# EAGLE design pihat2 (EAGLE 9.6.2)
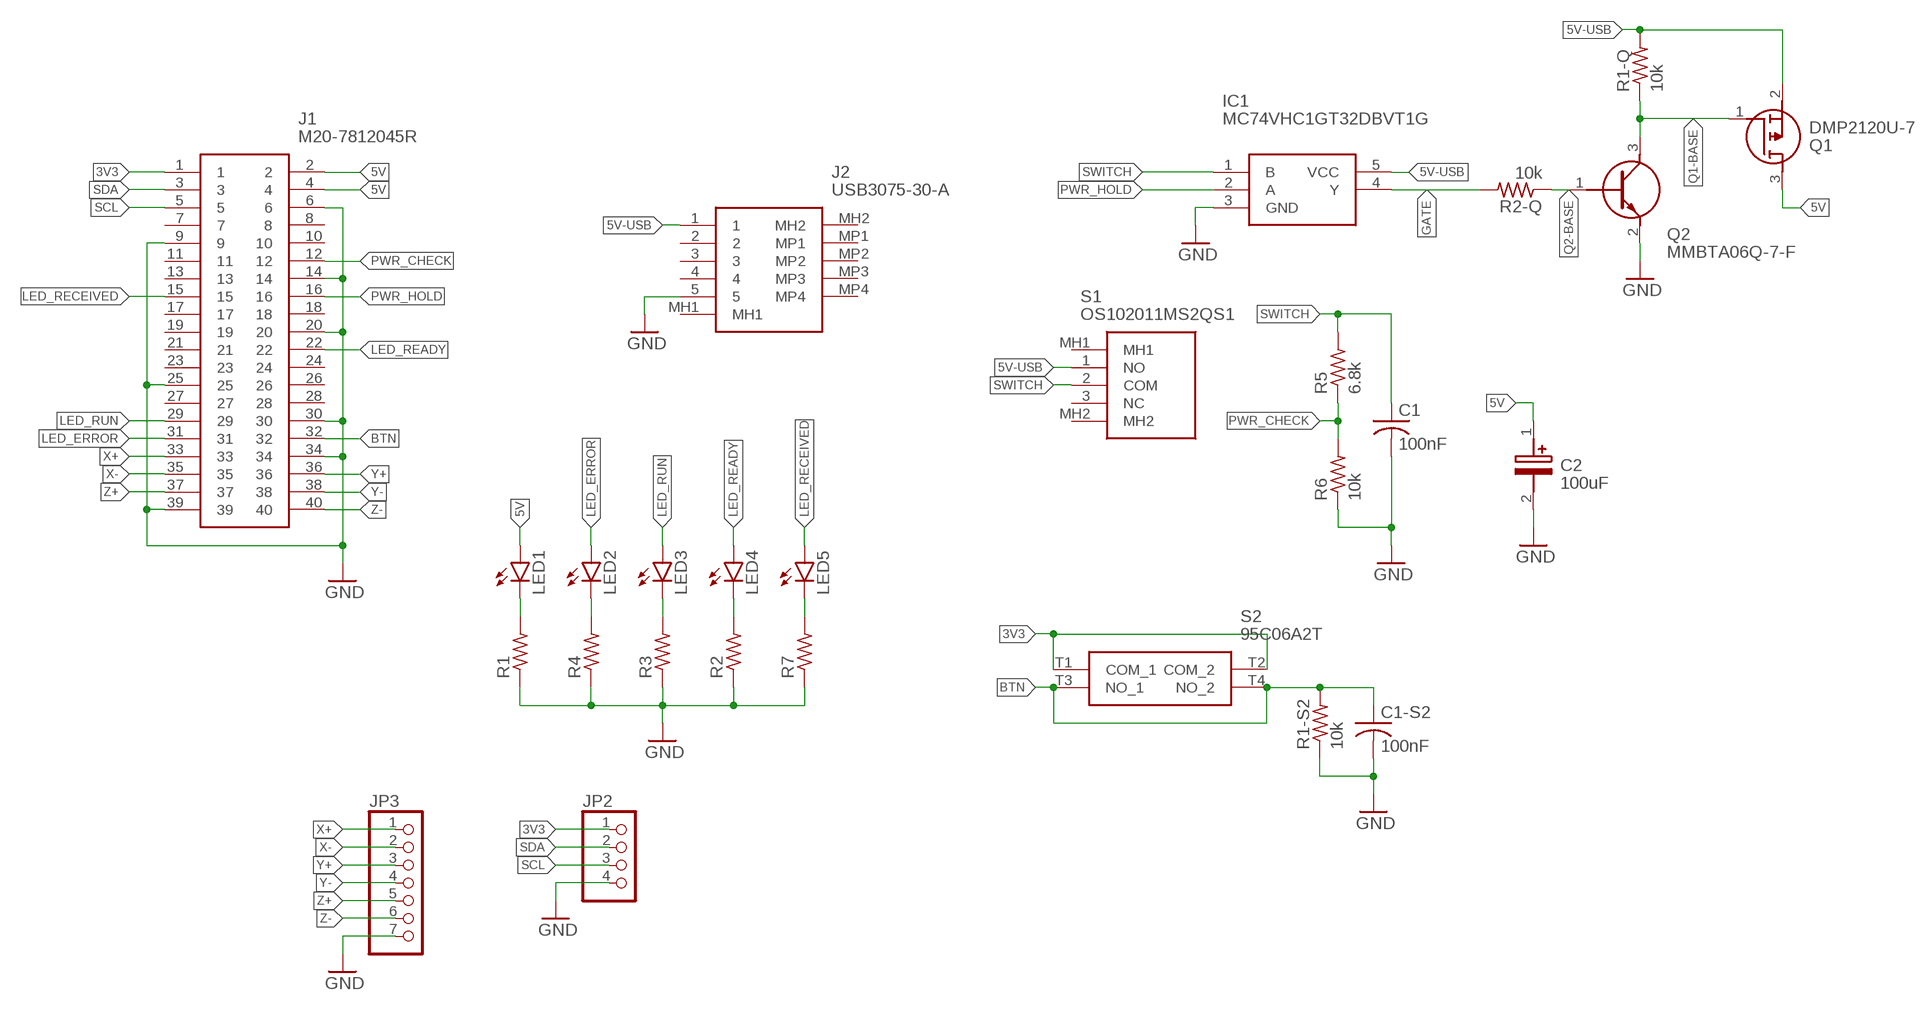
[diagram p0: schematic, sheet 1]

## Parts
C1  100nF  C-USC0805  [C0805]
C1-S2  100nF  C-USC0805  [C0805]
C2  100uF  10ML100MEFC6.3X5  [CAPPRD250W45D630H500]
IC1  MC74VHC1GT32DBVT1G  [MC74VHC1GT32DBVT1G]
J1  M20-7812045R  [M207812045R]
J2  USB3075-30-A  [USB307530A]
JP2  PINHD-1X4  [1X04]
JP3  PINHD-1X7  [1X07]
LED1  LED5MM  [LED5MM]
LED2  LED5MM  [LED5MM]
LED3  LED5MM  [LED5MM]
LED4  LED5MM  [LED5MM]
LED5  LED5MM  [LED5MM]
Q1  DMP2120U-7  [SOT96P240X110-3N]
Q2  MMBTA06Q-7-F  [SOT95P240X120-3N]
R1  R-US_R0805  [R0805]
R1-Q  10k  R-US_R0805  [R0805]
R1-S2  10k  R-US_R0805  [R0805]
R2  R-US_R0805  [R0805]
R2-Q  10k  R-US_R0805  [R0805]
R3  R-US_R0805  [R0805]
R4  R-US_R0805  [R0805]
R5  6.8k  R-US_R0805  [R0805]
R6  10k  R-US_R0805  [R0805]
R7  R-US_R0805  [R0805]
S1  OS102011MS2QS1  [OS102011MS2QS1]
S2  95C06A2T  [95C06A2T]

## Nets
3V3: J1.1 JP2.1 S2.T1(COM_1) S2.T2(COM_2)
5V: C2.1(+) J1.2 J1.4 LED1.A Q1.3(D)
5V-USB: IC1.5(VCC) J2.1 Q1.2(S) R1-Q.2 S1.1(NO)
BTN: C1-S2.1 J1.32 R1-S2.2 S2.T3(NO_1) S2.T4(NO_2)
GATE: IC1.4(Y) R2-Q.2
GND: C1-S2.2 C1.2 C2.2(-) IC1.3(GND) J1.6 J1.9 J1.14 J1.20 J1.25 J1.30 J1.34 J1.39 J2.5 JP2.4 JP3.7 Q2.2(E) R1-S2.1 R1.1 R2.1 R3.1 R4.1 R6.1 R7.1
LED_ERROR: J1.31 LED2.A
LED_READY: J1.22 LED4.A
LED_RECEIVED: J1.15 LED5.A
LED_RUN: J1.29 LED3.A
N$1: LED1.K(C) R1.2
N$2: LED2.K(C) R4.2
N$3: LED3.K(C) R3.2
N$4: LED4.K(C) R2.2
N$11: LED5.K(C) R7.2
PWR_CHECK: J1.12 R5.1 R6.2
PWR_HOLD: IC1.2(A) J1.16
Q1-BASE: Q1.1(G) Q2.3(C) R1-Q.1
Q2-BASE: Q2.1(B) R2-Q.1
SCL: J1.5 JP2.3
SDA: J1.3 JP2.2
SWITCH: C1.1 IC1.1(B) R5.2 S1.2(COM)
X+: J1.33 JP3.1
X-: J1.35 JP3.2
Y+: J1.36 JP3.3
Y-: J1.38 JP3.4
Z+: J1.37 JP3.5
Z-: J1.40 JP3.6
Unconnected: J1.7 J1.8 J1.10 J1.11 J1.13 J1.17 J1.18 J1.19 J1.21 J1.23 J1.24 J1.26 J1.27 J1.28 J2.2 J2.3 J2.4 J2.MH1 J2.MH2 J2.MP1 J2.MP2 J2.MP3 J2.MP4 S1.3(NC) S1.MH1 S1.MH2

## Library data of the parts
C1 C1-S2 = rcl:C-US: CAPACITOR, American symbol; SPICEPREFIX: C
C2 = SamacSys_Parts:10ML100MEFC6.3X5: Rubycon 100uF 10 V dc Aluminium Electrolytic Capacitor, ML Series 3000h 6.3 Dia. x 5mm Source: Datasheet <http://www.rubycon.co.jp/en/catalog/e_pdfs/aluminum/e_ml.pdf>; DESCRIPTION: Rubycon 100uF 10 V dc Aluminium Electrolytic Capacitor, ML Series 3000h 6.3 Dia. x 5mm; HEIGHT: 5mm; MANUFACTURER_NAME: Rubycon; MANUFACTURER_PART_NUMBER: 10ML100MEFC6.3X5; MOUSER_PART_NUMBER: 232-10ML100MEFC6.3X5; MOUSER_PRICE-STOCK: https://www.mouser.co.uk/ProductDetail/Rubycon/10ML100MEFC63X5?qs=T3oQrply3y%2Ft1pH0%2F%252B5skA%3D%3D
IC1 = SamacSys_Parts:MC74VHC1GT32DBVT1G: Logic Gates Single 2-Input OR Gate TTL Level Source: Datasheet <https://www.onsemi.com/pub/Collateral/MC74VHC1G32-D.PDF>; DESCRIPTION: Logic Gates Single 2-Input OR Gate TTL Level; HEIGHT: 1.1mm; MANUFACTURER_NAME: ON Semiconductor; MANUFACTURER_PART_NUMBER: MC74VHC1GT32DBVT1G; MOUSER_PART_NUMBER: 863-MC74VHC1GT32DBVG; MOUSER_PRICE-STOCK: https://www.mouser.co.uk/ProductDetail/onsemi/MC74VHC1GT32DBVT1G?qs=vLWxofP3U2z75t%252B%2F4%252B1fSQ%3D%3D
J1 = SamacSys_Parts:M20-7812045R: 2.54mm (0.1") Pitch DIL SMT Dual Entry Socket Assembly, with locating pegs, selective gold + tin, 20+20 contacts, with pick & place cap (Tape & Reel packing) Source: Datasheet <https://cdn.harwin.com/pdfs/M20-781.pdf>; DESCRIPTION: 2.54mm (0.1") Pitch DIL SMT Dual Entry Socket Assembly, with locating pegs, selective gold + tin, 20+20 contacts, with pick & place cap (Tape & Reel packing); HEIGHT: 4mm; MANUFACTURER_NAME: Harwin; MANUFACTURER_PART_NUMBER: M20-7812045R; MOUSER_PART_NUMBER: 855-M20-7812045R; MOUSER_PRICE-STOCK: https://www.mouser.co.uk/ProductDetail/Harwin/M20-7812045R?qs=k41KVqW3ymrSUFsY4Ced7g%3D%3D
J2 = SamacSys_Parts:USB3075-30-A: GCT (GLOBAL CONNECTOR TECHNOLOGY) - USB3075-30-A - USB Connector, Micro USB Type B, USB 2.0, Receptacle, 5 Ways, Surface Mount, Right Angle Source: Datasheet <https://componentsearchengine.com/Datasheets/2/USB3075-30-A.pdf>; DESCRIPTION: GCT (GLOBAL CONNECTOR TECHNOLOGY) - USB3075-30-A - USB Connector, Micro USB Type B, USB 2.0, Receptacle, 5 Ways, Surface Mount, Right Angle; HEIGHT: 2.7mm; MANUFACTURER_NAME: GCT (GLOBAL CONNECTOR TECHNOLOGY); MANUFACTURER_PART_NUMBER: USB3075-30-A; MOUSER_PART_NUMBER: 640-USB3075-30-A; MOUSER_PRICE-STOCK: https://www.mouser.co.uk/ProductDetail/GCT/USB3075-30-A?qs=KUoIvG%2F9IlbGMJplbp1ybA%3D%3D
JP2 = pinhead:PINHD-1X4: PIN HEADER
JP3 = pinhead:PINHD-1X7: PIN HEADER
LED1-LED5 = led:LED: LED OSRAM: - CHIPLED LG R971, LG N971, LY N971, LG Q971, LY Q971, LO R971, LY R971 LH N974, LH R974 LS Q976, LO Q976, LY Q976 LO Q996 - Hyper CHIPLED LW Q18S LB Q993, LB Q99A, LB R99A - SideLED LS A670, LO A670, LY A670, LG A670, LP A670 LB A673, LV A673, LT A673, LW A673 LH A674 LY A675 LS A676, LA A676, LO A676, LY A676, LW A676 LS A679, LY A679, LG A679 - Hyper Micro SIDELED® LS Y876, LA Y876, LO Y876, LY Y876 LT Y87S - SmartLED LW L88C, LW L88S LB L89C, LB L89S, LG L890 LS L89K, LO L89K, LY L89K LS L896, LA L896, LO L896, LY L896 - TOPLED LS T670, LO T670, LY T670, LG T670, LP T670 LSG T670, LSP T670, LSY T670, LOP T670, LYG T670 LG T671, LOG T671, LSG T671 LB T673, LV T673, LT T673, LW T673 LH T674 LS T676, LA T676, LO T676, LY T676, LB T676, LH T676, LSB T676, LW T676 LB T67C, LV T67C, LT T67C, LS T67K, LO T67K, LY T67K, LW E67C LS E67B, LA E67B, LO E67B, LY E67B, LB E67C, LV E67C, LT E67C LW T67C LS T679, LY T679, LG T679 LS T770, LO T770, LY T770, LG T770, LP T770 LB T773, LV T773, LT T773, LW T773 LH T774 LS E675, LA E675, LY E675, LS T675 LS T776, LA T776, LO T776, LY T776, LB T776 LHGB T686 LT T68C, LB T68C - Hyper Mini TOPLED® LB M676 - Mini TOPLED Santana® LG M470 LS M47K, LO M47K, LY M47K Source: http://www.osram.convergy.de LUXEON: - LUMILED® LXK2-PW12-R00, LXK2-PW12-S00, LXK2-PW14-U00, LXK2-PW14-V00 LXK2-PM12-R00, LXK2-PM12-S00, LXK2-PM14-U00 LXK2-PE12-Q00, LXK2-PE12-R00, LXK2-PE12-S00, LXK2-PE14-T00, LXK2-PE14-U00 LXK2-PB12-K00, LXK2-PB12-L00, LXK2-PB12-M00, LXK2-PB14-N00, LXK2-PB14-P00, LXK2-PB14-Q00 LXK2-PR12-L00, LXK2-PR12-M00, LXK2-PR14-Q00, LXK2-PR14-R00 LXK2-PD12-Q00, LXK2-PD12-R00, LXK2-PD12-S00 LXK2-PH12-R00, LXK2-PH12-S00 LXK2-PL12-P00, LXK2-PL12-Q00, LXK2-PL12-R00 Source: www.luxeon.com KINGBRIGHT: KA-3528ASYC Source: www.kingbright.com
Q1 = SamacSys_Parts:DMP2120U-7: DMP2120U-7 P-Channel MOSFET, 3 (State) A, 3.8 (Steady) A, 20 V, 3-Pin SOT-23 Diodes Inc Source: Datasheet <https://www.diodes.com/assets/Datasheets/DMP2120U.pdf>; DESCRIPTION: DMP2120U-7 P-Channel MOSFET, 3 (State) A, 3.8 (Steady) A, 20 V, 3-Pin SOT-23 Diodes Inc; HEIGHT: 1.1mm; MANUFACTURER_NAME: Diodes Inc.; MANUFACTURER_PART_NUMBER: DMP2120U-7; MOUSER_PART_NUMBER: 621-DMP2120U-7; MOUSER_PRICE-STOCK: https://www.mouser.co.uk/ProductDetail/Diodes-Incorporated/DMP2120U-7?qs=rrS6PyfT74danH7MTikTvQ%3D%3D
Q2 = SamacSys_Parts:MMBTA06Q-7-F: Bipolar Transistors - BJT NPN Small Sig Trans 60Vcbo 60Vceo 4.0V Source: Datasheet; DESCRIPTION: Bipolar Transistors - BJT NPN Small Sig Trans 60Vcbo 60Vceo 4.0V; HEIGHT: 1.2mm; MANUFACTURER_NAME: Diodes Inc.; MANUFACTURER_PART_NUMBER: MMBTA06Q-7-F; MOUSER_PART_NUMBER: 621-MMBTA06Q-7-F; MOUSER_PRICE-STOCK: https://www.mouser.co.uk/ProductDetail/Diodes-Incorporated/MMBTA06Q-7-F?qs=Ey7%2FXF42M3ezMyEM3xeIXQ%3D%3D
R1 R1-Q R1-S2 R2 R2-Q R3-R7 = rcl:R-US_: RESISTOR, American symbol; SPICEPREFIX: R
S1 = SamacSys_Parts:OS102011MS2QS1: C & K COMPONENTS - OS102011MS2QS1 - SWITCH SLIDE SHORTING SPDT Source: Datasheet <https://www.ckswitches.com/media/1428/os.pdf>; DESCRIPTION: C & K COMPONENTS - OS102011MS2QS1 - SWITCH SLIDE SHORTING SPDT; HEIGHT: 8.7mm; MANUFACTURER_NAME: C & K COMPONENTS; MANUFACTURER_PART_NUMBER: OS102011MS2QS1; MOUSER_PART_NUMBER: 611-OS102011MS2QS1; MOUSER_PRICE-STOCK: https://www.mouser.co.uk/ProductDetail/CK/OS102011MS2QS1?qs=WtljUlYws5TrGs9OfHrZYw%3D%3D
S2 = SamacSys_Parts:95C06A2T: GRAYHILL - 95C06A2T - TACTILE SWITCH, SPST, 0.05A, 12V, TH Source: Datasheet <https://componentsearchengine.com/Datasheets/1/95C06A2T.pdf>; DESCRIPTION: GRAYHILL - 95C06A2T - TACTILE SWITCH, SPST, 0.05A, 12V, TH; HEIGHT: 4.29mm; MANUFACTURER_NAME: Grayhill; MANUFACTURER_PART_NUMBER: 95C06A2T; MOUSER_PART_NUMBER: 706-95C06A2T; MOUSER_PRICE-STOCK: https://www.mouser.co.uk/ProductDetail/Grayhill/95C06A2T?qs=ls7QRyWmRk5FxCZi6XkIdQ%3D%3D

## Board
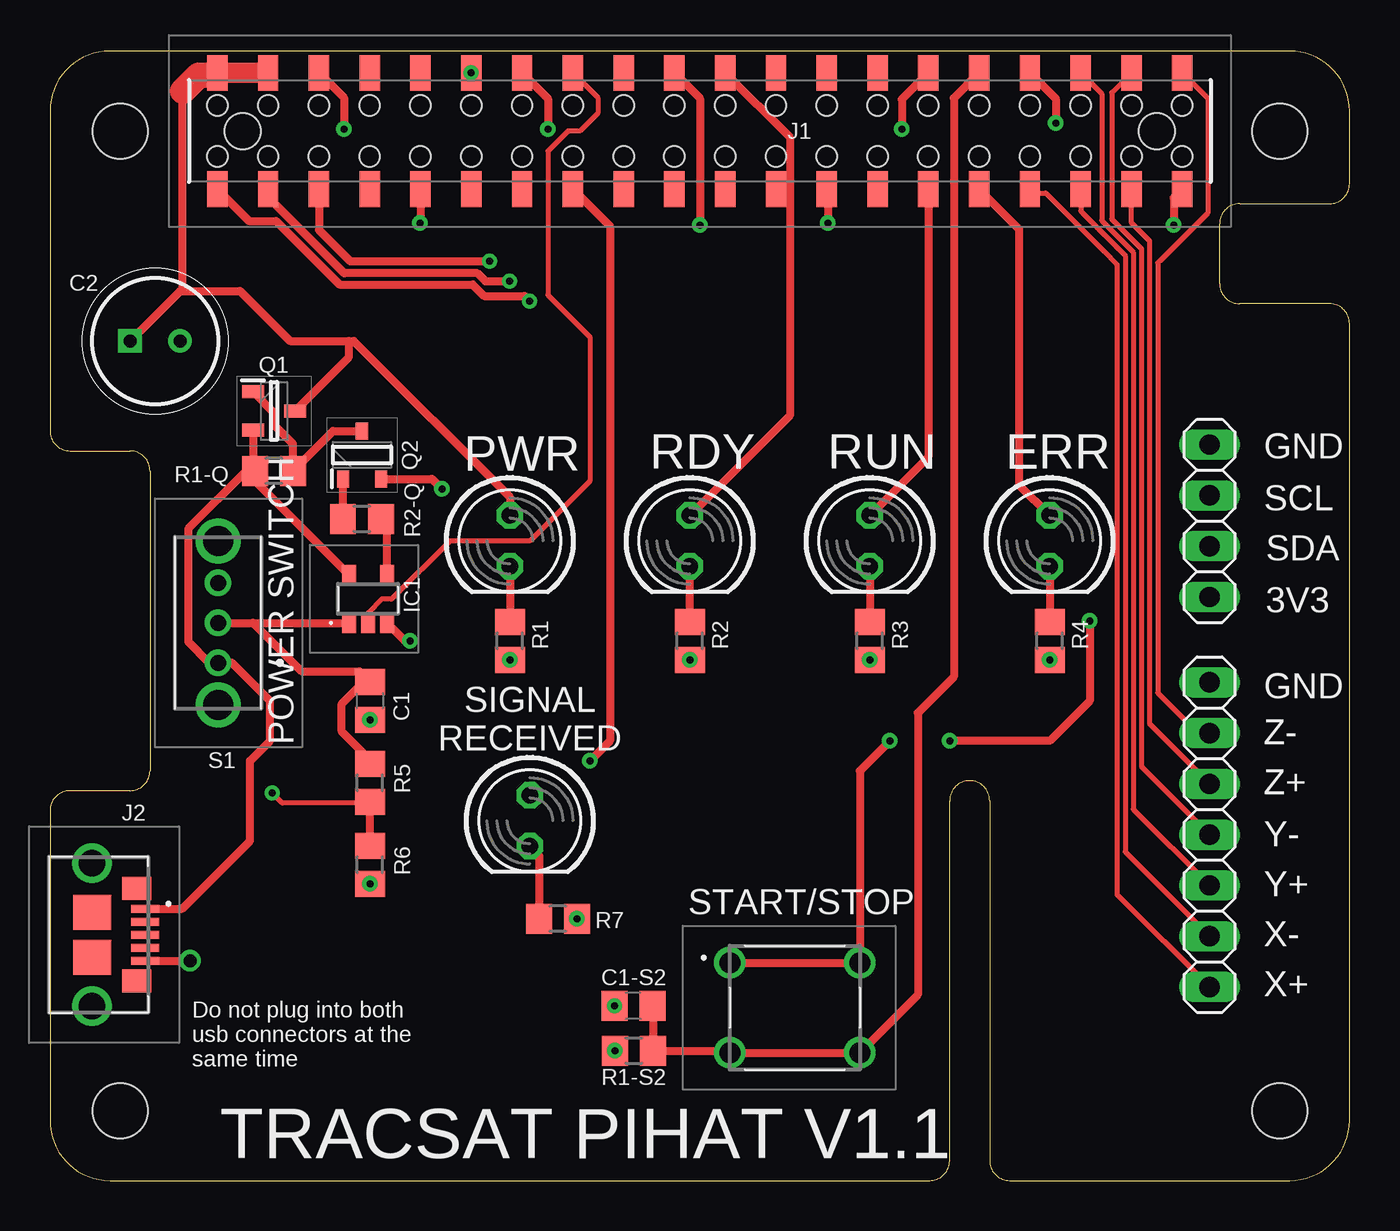
[diagram p1: board, top side]
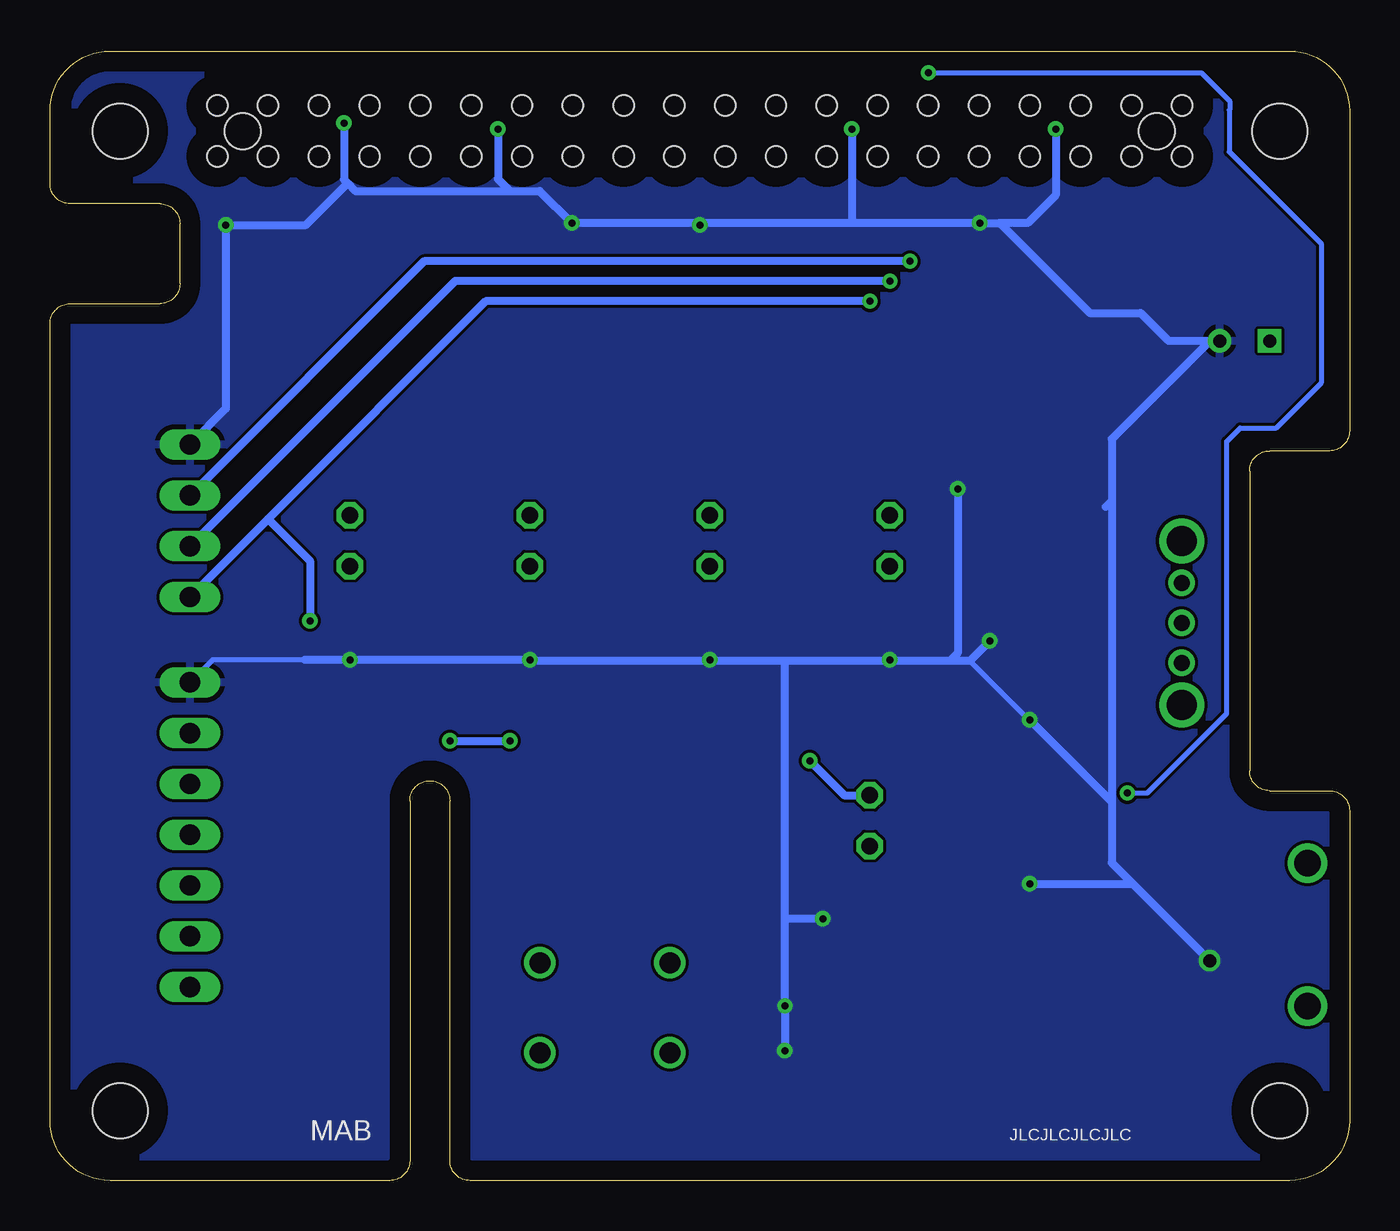
[diagram p2: board, bottom side, seen from below]

Size 65 x 56.5 mm. Coordinates in mm from the lower left corner, seen from the top.
Outline: 4,19.5 1,19.5 arc90 0,18.5 0,3 arc90 3,0 44,0 arc90 45,1 45,19 arc-180 47,19 47,1 arc90 48,0 62,0 arc90 65,3 65,42.86 arc90 64,43.86 59.5,43.86 arc-90 58.5,44.86 58.5,47.86 arc-90 59.5,48.86 64,48.86 arc90 65,49.86 65,53.5 arc90 62,56.5 3,56.5 arc90 0,53.5 0,37.5 arc90 1,36.5 4,36.5 arc-90 5,35.5 5,20.5 arc-90 4,19.5
Copper layers (1*16): Top 0.035mm / dielectric 1.5mm / Bottom 0.035mm
Design rules "default": minimum track width 6mil, minimum drill 0.35mm, track to track 6mil, track to pad 6mil, pad to pad 6mil, via to via 6mil, smd to smd 6mil, copper to edge 40mil, drill to drill 6mil, minimum pad ring 10mil, minimum via ring 8mil, stop-mask expansion 4mil, vias tented up to drill 0mil, thermal gap 10mil
Holes 2.75 mm at 61.5,3.5 3.5,3.5 3.5,52.5 61.5,52.5

### Footprints (pad centres in the part's own frame; a part is rotated, then mirrored left to right if it is on the bottom)
C0805 = smd 1.3 x 1.5: 1 -0.95,0; 2 0.95,0
CAPPRD250W45D630H500 = drill 0.65 pad 1.05 square: 1 0,0 | drill 0.65 pad 1.05: 2 2.5,0
MC74VHC1GT32DBVT1G = smd 0.7 x 1: 1 -0.95,-1.2; 2 0,-1.2; 3 0.95,-1.2; 4 0.95,1.2; 5 -0.95,1.2
M207812045R = smd 1.02 x 1.78: 1 -24.13,-2.91; 2 -24.13,2.91; 3 -21.59,-2.91; 4 -21.59,2.91; 5 -19.05,-2.91; 6 -19.05,2.91; 7 -16.51,-2.91; 8 -16.51,2.91; 9 -13.97,-2.91; 10 -13.97,2.91; 11 -11.43,-2.91; 12 -11.43,2.91; 13 -8.89,-2.91; 14 -8.89,2.91; 15 -6.35,-2.91; 16 -6.35,2.91; 17 -3.81,-2.91; 18 -3.81,2.91; 19 -1.27,-2.91; 20 -1.27,2.91; 21 1.27,-2.91; 22 1.27,2.91; 23 3.81,-2.91; 24 3.81,2.91; 25 6.35,-2.91; 26 6.35,2.91; 27 8.89,-2.91; 28 8.89,2.91; 29 11.43,-2.91; 30 11.43,2.91; 31 13.97,-2.91; 32 13.97,2.91; 33 16.51,-2.91; 34 16.51,2.91; 35 19.05,-2.91; 36 19.05,2.91; 37 21.59,-2.91; 38 21.59,2.91; 39 24.13,-2.91; 40 24.13,2.91 | hole 1.02: -24.13,-1.27; -24.13,1.27; -21.59,-1.27; -21.59,1.27; -19.05,-1.27; -19.05,1.27; -16.51,-1.27; -16.51,1.27; -13.97,-1.27; -13.97,1.27; -11.43,-1.27; -11.43,1.27; -8.89,-1.27; -8.89,1.27; -6.35,-1.27; -6.35,1.27; -3.81,-1.27; -3.81,1.27; -1.27,-1.27; -1.27,1.27; 1.27,-1.27; 1.27,1.27; 3.81,-1.27; 3.81,1.27; 6.35,-1.27; 6.35,1.27; 8.89,-1.27; 8.89,1.27; 11.43,-1.27; 11.43,1.27; 13.97,-1.27; 13.97,1.27; 16.51,-1.27; 16.51,1.27; 19.05,-1.27; 19.05,1.27; 21.59,-1.27; 21.59,1.27; 24.13,-1.27; 24.13,1.27 | hole 1.8: -22.86,0; 22.86,0
USB307530A = smd 0.4 x 1.4: 1 -1.3,2.65; 2 -0.65,2.65; 3 0,2.65; 4 0.65,2.65; 5 1.3,2.65 | drill 1.329 pad 1.85: MH1 -3.575,0; MH2 3.575,0 | smd 1.75 x 1.9: MP1 -1.125,0; MP2 1.125,0 | smd 1.15 x 1.45: MP3 -2.32,2.23; MP4 2.32,2.23
1X04 = drill 1.016 long: 1 -3.81,0; 2 -1.27,0; 3 1.27,0; 4 3.81,0
1X07 = drill 1.016 long: 1 -7.62,0; 2 -5.08,0; 3 -2.54,0; 4 0,0; 5 2.54,0; 6 5.08,0; 7 7.62,0
LED5MM = drill 0.813 octagon: A -1.27,0; K 1.27,0
SOT96P240X110-3N = smd 1.1 x 0.65: 1 -1.05,0.96; 2 -1.05,-0.96; 3 1.05,0
SOT95P240X120-3N = smd 0.85 x 0.6: 1 -1.2,0.95; 2 -1.2,-0.95; 3 1.2,0
R0805 = smd 1.3 x 1.5: 1 -0.95,0; 2 0.95,0
OS102011MS2QS1 = drill 0.8 pad 1.3: 1 0,0; 2 2,0; 3 4,0 | drill 1.5 pad 2.25: MH1 -2.1,0; MH2 6.1,0
95C06A2T = drill 1.05 pad 1.575: T1 0,0; T2 6.5,0; T3 0,-4.5; T4 6.5,-4.5

### Placement (x,y rotation side)
C1  16,24 270 top
C1-S2  29.18,8.74 180 top
C2  4,42 0 top
IC1  15.9,29.1 0 top
J1  32.5,52.5 0 top
J2  2.1,12.3 270 top
JP2  58,33 90 top
JP3  58,17.3 90 top
LED1  23,32 270 top
LED2  50,32 270 top
LED3  41,32 270 top
LED4  32,32 270 top
LED5  24,18 270 top
Q1  11.2,38.5 0 top
Q2  15.6,36.3 90 top
R1  23,27 90 top
R1-Q  11.2,35.5 180 top
R1-S2  29.2,6.5 0 top
R2  32,27 90 top
R2-Q  15.6,33.1 0 top
R3  41,27 90 top
R4  50,27 90 top
R5  16,19.9 90 top
R6  16,15.8 90 top
R7  25.4,13.1 180 top
S1  8.4,25.9 90 top
S2  34,10.9 0 top

### Tracks (layer width: path | path; a pad name or v marks a point on that pad's centre or on a via)
3V3  (via drill 0.35)
  Top 0.406: J1.1 9.96,48 11.31,48 14.49,44.82 21.15,44.82 21.73,44.25 23.71,44.25 v23.98,43.98 | v52,28 52,24 50,22 v45,22 | v42,22 40.5,20.5 S2.T2 S2.T1
  Bottom 0.406: 54.09,33.09 43.21,43.98 v23.98,43.98 | 54.09,33.09 JP2.1 | 54.09,33.09 52,31 v52,28 | v45,22 v42,22
5V
  Top 0.406: J1.2 8.24,55.28 | C2.1 6.5,44.5 | 6.5,44.5 6.64,44.64 6.64,54.49 | 6.5,44.5 9.5,44.5 12,42 14.95,42 | LED1.A 23,34.19 15.19,42 14.95,42 | Q1.3 14.95,41.2 14.95,42
  Top 1.016: J1.2 J1.4
  Top 1.27: 6.64,54.49 7.43,55.28 8.24,55.28
5V-USB
  Top 0.406: J2.1 6.6,13.6 10,17 10,21 11,22 11,24 9.1,25.9 S1.1 7.97,25.9 6.92,26.95 6.92,32.61 9.81,35.5 R1-Q.2 | Q1.2 10.15,35.6 R1-Q.2 | IC1.5 10.25,35 R1-Q.2
BTN
  Top 0.406: C1-S2.1 30.15,8.72 R1-S2.2 33.9,6.5 S2.T3 S2.T4 43.4,9.3 43.4,23.4 45.2,25.2 45.2,54.14 J1.32
GATE
  Top 0.406: IC1.4 16.85,32.8 R2-Q.2
GND  (via drill 0.35, 0.35 pad 0.55, 0.65)
  Top 0.406: J1.9 18.53,47.93 v18.5,47.9 | J1.14 24.9,54.12 v24.9,52.6 | J1.20 32.5,54.14 v32.5,47.8 | J1.30 42.6,54.08 v42.6,52.6 | J1.34 50.3,54.12 v50.3,52.9 | J1.39 56.2,49.16 v56.2,47.8 | J1.25 38.9,49.54 v38.9,47.9 | J1.6 14.7,54.16 v14.7,52.6 | IC1.3 17.75,27 v18,27 | Q2.2 19.1,35.1 v19.6,34.6 | J2.5 v7,11
  Bottom 0.254: 52,26.05 56.87,26.05 JP3.7 | C1.2 16.05,23.05 19,26
  Bottom 0.406: R1-S2.1 28.25,8.72 C1-S2.2 28.23,13 | R1.1 23.05,26 | 23.05,26 28.23,26 | 28.23,26 32,26 R2.1 32.05,26 41,26 R3.1 R4.1 52,26.05 52.24,26.05 | 28.23,13 28.23,26 | 17.5,47.9 v18.5,47.9 25,47.9 | 17.5,47.9 13,43.4 10.45,43.4 9.05,42 C2.2 7,42 11.9,37.1 11.9,34 | 25,47.9 32.4,47.9 | 32.4,47.9 v38.9,47.9 40.5,49.5 42,49.5 | v24.9,52.6 24.9,48 25,47.9 | 50.11,49.89 52.2,47.8 v56.2,47.8 56.2,38.61 JP2.4 | 50.11,49.89 49.73,49.5 42,49.5 | v42.6,52.6 42.6,50.1 42,49.5 | v32.5,47.8 32.4,47.9 | v50.3,52.9 50.3,50.08 50.11,49.89 | v14.7,52.6 14.7,49.3 16.1,47.9 17.5,47.9 | 10.85,14.85 11.9,15.9 11.9,18.95 | 11.9,34 11.9,18.95 | R6.1 10.85,14.85 | C1.2 11.9,18.95 | v7,11 10.85,14.85 | 12.2,33.7 11.9,34 | R7.1 28.13,13.1 28.23,13 | v18,27 19,26 20,26 | 20,26 23.05,26 | v19.6,34.6 19.6,26.4 20,26
  other vias: 28.25,6.5 28.23,8.74 23,26.05 32,26.05 41,26.05 50,26.05 16,14.85 16,23.05 26.35,13.1
  pour Bottom (rank 2): -2,58 -2,-2 67,-2 67,58
LED_ERROR
  Top 0.406: J1.31 48.47,47.59 48.47,34.8 LED2.A
LED_READY
  Top 0.406: J1.22 37,52.18 37,38.27 LED4.A
LED_RECEIVED  (via drill 0.35 pad 0.55)
  Top 0.406: J1.15 28,47.74 28,22 v27,21
  Bottom 0.406: v27,21 25.27,19.27 LED5.A
LED_RUN
  Top 0.406: J1.29 43.93,36.2 LED3.A
N$1
  Top 0.406: LED1.K R1.2
N$2
  Top 0.406: LED2.K R4.2
N$3
  Top 0.406: LED3.K R3.2
N$4
  Top 0.406: R2.2 LED4.K
N$11
  Top 0.406: LED5.K 24.45,16.28 R7.2
PWR_CHECK  (via drill 0.35 pad 0.55)
  Top 0.254: R5.1 15.93,18.88 11.62,18.88 v11.12,19.38
  Top 0.406: R6.2 R5.1
  Bottom 0.254: v11.12,19.38 10.12,19.38 6.14,23.36 6.14,36.97 5.47,37.64 3.67,37.64 1.39,39.92 1.39,46.83 6.02,51.46 6.02,53.54 6,53.56 6,54 7.41,55.41 14,55.41 J1.12
  other vias: 21.07,55.41
PWR_HOLD
  Top 0.254: J1.16 27.4,54.16 27.4,53.4 26.5,52.5 25.9,52.5 24.9,51.5 24.9,44.3 27,42.2 27,35 24,32 20,32 17.08,29.08 16.58,29.08 15.9,28.39 IC1.2
Q1-BASE
  Top 0.406: Q2.3 14.15,37.5 R1-Q.1 12.15,36.85 11.24,37.76 11.24,38.37 Q1.1
Q2-BASE
  Top 0.406: R2-Q.1 Q2.1
SCL  (via drill 0.35)
  Top 0.406: v21.98,45.98 15.02,45.98 13.45,47.55 J1.5
  Bottom 0.406: JP2.3 46.29,45.98 v21.98,45.98
SDA  (via drill 0.35)
  Top 0.406: J1.3 10.91,49.19 14.72,45.38 21.38,45.38 21.78,44.98 v22.98,44.98
  Bottom 0.406: v22.98,44.98 23,45 44.73,45 JP2.2
SWITCH
  Top 0.406: S1.2 10.16,27.9 | R5.2 16,21.05 14.59,22.45 14.59,23.85 15.7,24.95 C1.1 15.48,25.47 12.6,25.47 10.16,27.9 | 10.16,27.9 IC1.1
X+
  Top 0.254: J1.33 49.2,49.4 49.8,49.4 52.6,46.6 52.7,46.5 53.37,45.83 53.37,14.31 JP3.1
X-
  Top 0.254: J1.35 51.55,48.5 53.02,47.02 53.14,46.91 53.78,46.27 53.78,16.44 JP3.2
Y+
  Top 0.254: J1.36 52.6,54.36 52.6,48.02 54.19,46.44 54.19,18.57 JP3.3
Y-
  Top 0.254: J1.38 53.1,54.42 53.1,48.1 54.1,47.1 54.15,47.05 54.59,46.61 54.59,20.71 JP3.4
Z+
  Top 0.254: J1.37 54.09,47.91 55,47 55,22.84 JP3.5
Z-
  Top 0.254: J1.40 57.9,54.14 57.9,48.4 55.75,46.25 55.5,46 55.41,45.91 55.41,24.39 57.42,22.38 JP3.6

### Text on the board
tNames: PWR | RDY | RUN | ERR | GND | SCL | SDA | 3V3 | GND | SIGNAL / RECEIVED | POWER SWITCH | Z- | Z+ | Y- | Y+ | START/STOP | X- | X+ | Do not plug into both / usb connectors at the / same time | TRACSAT PIHAT V1.1
bNames: JLCJLCJLCJLC | MAB